# EAGLE schematic LcdModule-16x2_1V0 (EAGLE 7.7.0)
DF4IAH - 10 MHz Reference Oscillator

## Sheet 1 of 2: Main
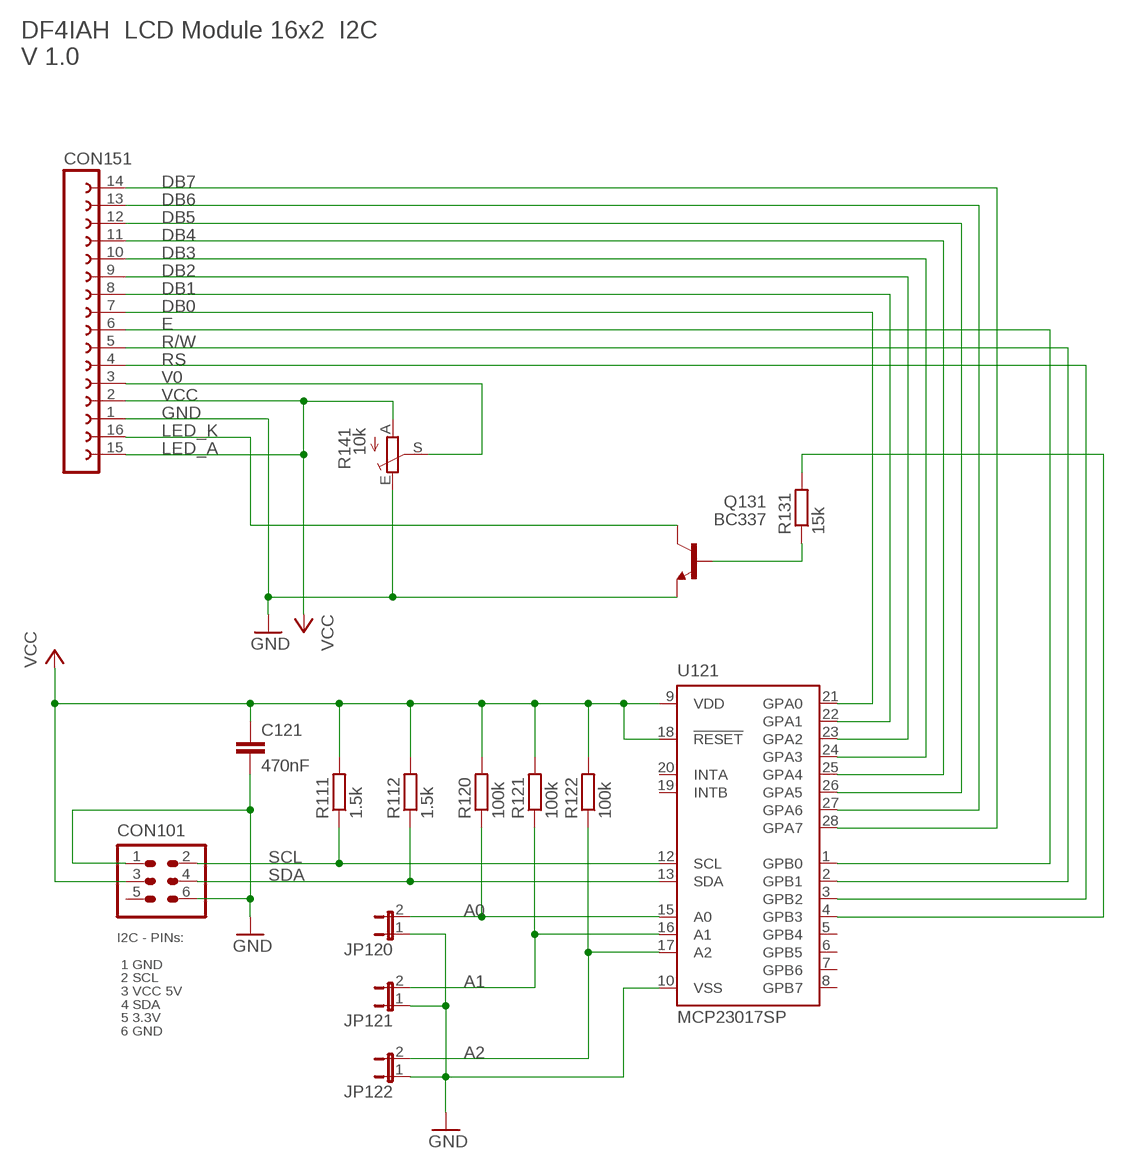
[diagram p0: schematic, sheet 1]

### Parts
C121  470nF  C-EUC0805  [C0805]
CON101  HEADER-2X3SMD  [2X03SMD]
CON151  CON_LCDBRD_16W  [CON_LCDBRD_16W]
JP120  JP1E  [JP1]
JP121  JP1E  [JP1]
JP122  JP1E  [JP1]
Q131  BC337  [TO92]
R111  1.5k  R-EU_R0805  [R0805]
R112  1.5k  R-EU_R0805  [R0805]
R120  100k  R-EU_R0805  [R0805]
R121  100k  R-EU_R0805  [R0805]
R122  100k  R-EU_R0805  [R0805]
R131  15k  R-EU_R0805  [R0805]
R141  10k  TRIM_EU-PT10  [PT-10]
U121  MCP23017SP  [DIL28-3]

### Nets
A0: JP120.2 R120.1 U121.15(A0)
A1: JP121.2 R121.1 U121.16(A1)
A2: JP122.2 R122.1 U121.17(A2)
DB0: CON151.7 U121.21(GPA0)
DB1: CON151.8 U121.22(GPA1)
DB2: CON151.9 U121.23(GPA2)
DB3: CON151.10 U121.24(GPA3)
DB4: CON151.11 U121.25(GPA4)
DB5: CON151.12 U121.26(GPA5)
DB6: CON151.13 U121.27(GPA6)
DB7: CON151.14 U121.28(GPA7)
E: CON151.6 U121.1(GPB0)
GND [N0V]: C121.2 CON101.1 CON101.6 CON151.1 JP120.1 JP121.1 JP122.1 Q131.1(E) R141.E U121.10(VSS) ; also sheet 2
LED: R131.2 U121.4(GPB3)
LED_K: CON151.16 Q131.3(C)
N$4: Q131.2(B) R131.1
R/W: CON151.5 U121.2(GPB1)
RS: CON151.4 U121.3(GPB2)
SCL: CON101.2 R111.1 U121.12(SCL)
SDA: CON101.4 R112.1 U121.13(SDA)
V0: CON151.3 R141.S
VCC [N5V]: C121.1 CON101.3 CON151.2 CON151.15 R111.2 R112.2 R120.2 R121.2 R122.2 R141.A U121.9(VDD) U121.18(!RESET)
Unconnected: CON101.5 U121.5(GPB4) U121.6(GPB5) U121.7(GPB6) U121.8(GPB7) U121.19(INTB) U121.20(INTA)

### Notes on the sheet
- DF4IAH  LCD Module 16x2  I2C
  V 1.0
- LED_A
- I2C - PINs:
  
   1 GND
   2 SCL
   3 VCC 5V
   4 SDA
   5 3.3V
   6 GND

## Sheet 2 of 2: Mount-Pads
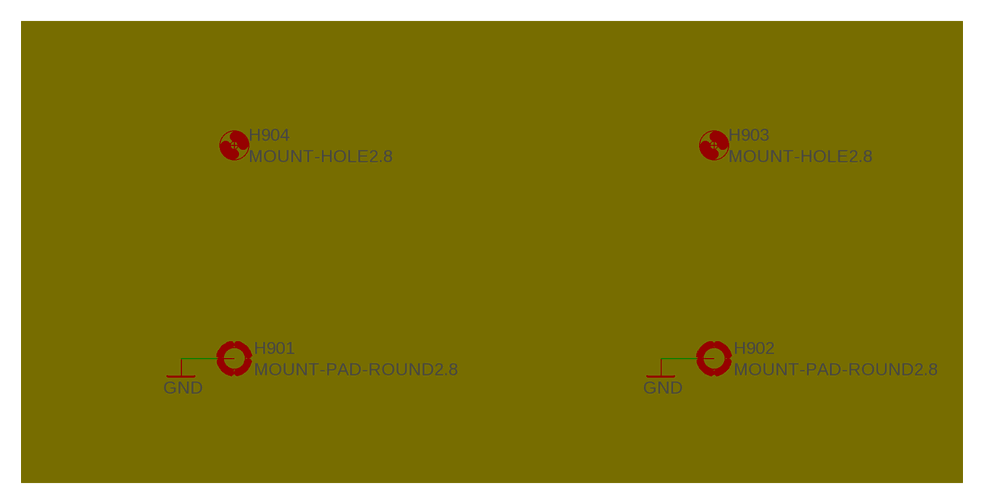
[diagram p1: schematic, sheet 2]

### Parts
H901  MOUNT-PAD-ROUND2.8  [2,8-PAD]
H902  MOUNT-PAD-ROUND2.8  [2,8-PAD]
H903  MOUNT-HOLE2.8  [2,8]
H904  MOUNT-HOLE2.8  [2,8]

### Nets
GND [N0V]: H901.B2,8(MOUNT) H902.B2,8(MOUNT) ; also sheet 1

## Library data of the parts
C121 = rcl:C-EU: CAPACITOR, European symbol
CON101 = df4iah:HEADER-2X3: Header 2X3 2.54mm ISP, ...
CON151 = df4iah_connector:CON_LCDBRD_16W: FEMALE HEADER; OC_FARNELL: unknown; OC_NEWARK: unknown
H901 H902 = holes:MOUNT-PAD-ROUND: MOUNTING PAD, round
H903 H904 = holes:MOUNT-HOLE: MOUNTING HOLE with drill center marker
JP120-JP122 = jumper:JP1E: JUMPER
Q131 = transistor-npn:BC337*: NPN Transistor
R111 R112 R120-R122 R131 = rcl:R-EU_: RESISTOR, European symbol
R141 = pot:TRIM_EU-: POTENTIOMETER
U121 = microchip:MCP23017: http://ww1.microchip.com/downloads/en/DeviceDoc/21952a.pdf Source: http://ww1.microchip.com/downloads/en/DeviceDoc/21952a.pdf; MF: MICROCHIP; MPN: MCP23017-E/SP; OC_FARNELL: 1332088; OC_NEWARK: 31K2959

## Net classes
1 N3V3: width 0.508 mm
2 N5V: width 0.508 mm
3 N0V: width 0.508 mm